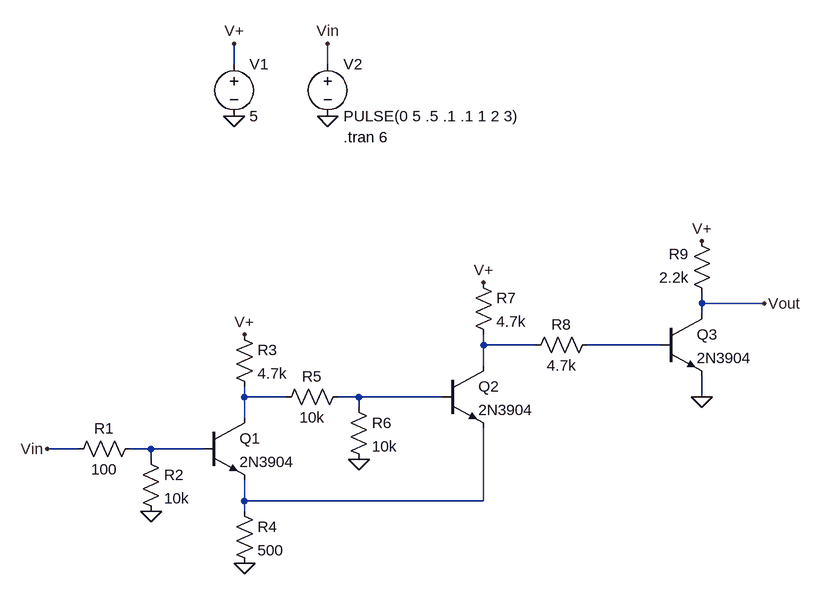
[diagram p0: schematic 10A-06.asc]
10A-06.asc, the LTspice schematic file:
Version 4.1
SHEET 1 1064 680
WIRE 176 -384 176 -416
WIRE 320 -384 320 -416
WIRE 896 -16 896 -32
WIRE 992 -16 896 -16
WIRE 896 0 896 -16
WIRE 560 48 560 32
WIRE 640 48 560 48
WIRE 832 48 720 48
WIRE 560 80 560 48
WIRE 192 128 192 112
WIRE 256 128 192 128
WIRE 368 128 336 128
WIRE 496 128 368 128
WIRE 896 128 896 96
WIRE 368 144 368 128
WIRE 192 160 192 128
WIRE -64 208 -112 208
WIRE 48 208 16 208
WIRE 128 208 48 208
WIRE 48 224 48 208
WIRE 192 288 192 256
WIRE 560 288 560 176
WIRE 560 288 192 288
WIRE 192 304 192 288
FLAG 176 -304 0
FLAG 320 -304 0
FLAG 176 -416 V+
FLAG 192 32 V+
FLAG 560 -48 V+
FLAG 896 -112 V+
FLAG 192 384 0
FLAG 48 304 0
FLAG 368 224 0
FLAG 896 128 0
FLAG 992 -16 Vout
FLAG -112 208 Vin
FLAG 320 -416 Vin
SYMBOL npn 128 160 R0
SYMATTR InstName Q1
SYMATTR Value 2N3904
SYMBOL npn 496 80 R0
SYMATTR InstName Q2
SYMATTR Value 2N3904
SYMBOL npn 832 0 R0
SYMATTR InstName Q3
SYMATTR Value 2N3904
SYMBOL res 32 192 R90
WINDOW 0 0 56 VBottom 2
WINDOW 3 32 56 VTop 2
SYMATTR InstName R1
SYMATTR Value 100
SYMBOL res 32 208 R0
SYMATTR InstName R2
SYMATTR Value 10k
SYMBOL res 176 16 R0
SYMATTR InstName R3
SYMATTR Value 4.7k
SYMBOL res 176 288 R0
SYMATTR InstName R4
SYMATTR Value 500
SYMBOL res 352 112 R90
WINDOW 0 0 56 VBottom 2
WINDOW 3 32 56 VTop 2
SYMATTR InstName R5
SYMATTR Value 10k
SYMBOL res 352 128 R0
SYMATTR InstName R6
SYMATTR Value 10k
SYMBOL res 544 -64 R0
SYMATTR InstName R7
SYMATTR Value 4.7k
SYMBOL res 736 32 R90
WINDOW 0 0 56 VBottom 2
WINDOW 3 32 56 VTop 2
SYMATTR InstName R8
SYMATTR Value 4.7k
SYMBOL res 912 -16 R180
WINDOW 0 36 76 Left 2
WINDOW 3 36 40 Left 2
SYMATTR InstName R9
SYMATTR Value 2.2k
SYMBOL voltage 176 -400 R0
WINDOW 123 0 0 Left 0
WINDOW 39 0 0 Left 0
SYMATTR InstName V1
SYMATTR Value 5
SYMBOL voltage 320 -400 R0
WINDOW 123 0 0 Left 0
WINDOW 39 0 0 Left 0
SYMATTR InstName V2
SYMATTR Value PULSE(0 5 .5 .1 .1 1 2 3)
TEXT 344 -272 Left 2 !.tran 6

The netlist it stands for:
* 10A-06.asc
Q1 N003 N005 N006 0 2N3904
Q2 N001 N004 N006 0 2N3904
Q3 Vout N002 0 0 2N3904
R1 N005 Vin 100
R2 N005 0 10k
R3 V+ N003 4.7k
R4 N006 0 500
R5 N004 N003 10k
R6 N004 0 10k
R7 V+ N001 4.7k
R8 N002 N001 4.7k
R9 Vout V+ 2.2k
V1 V+ 0 5
V2 Vin 0 PULSE(0 5 .5 .1 .1 1 2 3)
.model NPN NPN
.model PNP PNP
.lib standard.bjt
.tran 6
.backanno
.end